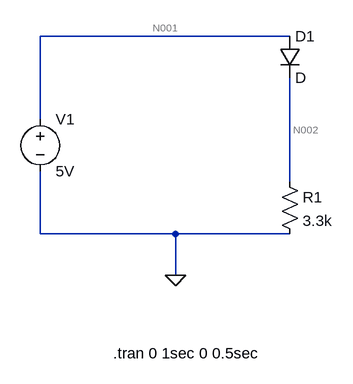
[diagram p0: schematic EC1.asc]
EC1.asc, the LTspice schematic file:
Version 4
SHEET 1 880 680
WIRE 272 -112 -112 -112
WIRE -112 16 -112 -112
WIRE 272 112 272 -48
WIRE -112 192 -112 96
WIRE 96 192 -112 192
WIRE 272 192 96 192
WIRE 96 256 96 192
FLAG 96 256 0
SYMBOL res 256 96 R0
SYMATTR InstName R1
SYMATTR Value 3.3k
SYMBOL voltage -112 0 R0
WINDOW 123 0 0 Left 0
WINDOW 39 0 0 Left 0
SYMATTR InstName V1
SYMATTR Value 5V
SYMBOL diode 256 -112 R0
SYMATTR InstName D1
TEXT 0 376 Left 2 !.tran 0 1sec 0 0.5sec

The netlist it stands for:
* EC1.asc
R1 N002 0 3.3k
V1 N001 0 5V
D1 N001 N002 D
.model D D
.lib standard.dio
.tran 0 1sec 0 0.5sec
.backanno
.end

* Results of the author's LTspice run, read from the files saved beside the schematic
* Operating Point, zero values left out:
*   V(n002) = 4.338 V
*   V(n001) = 5 V
*   I(D1) = 1.314 mA
*   I(R1) = 1.314 mA
*   I(V1) = -1.314 mA